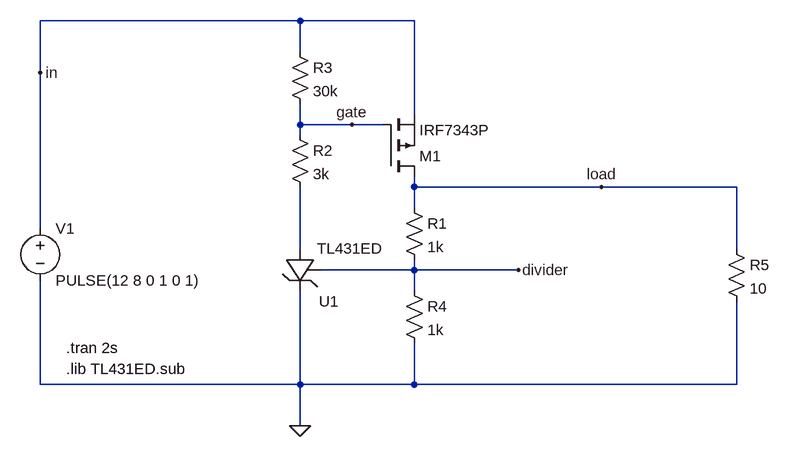
[diagram p0: schematic low_voltage_cut_off.asc]
low_voltage_cut_off.asc, the LTspice schematic file:
Version 4
SHEET 1 880 680
WIRE 112 -192 -288 -192
WIRE 288 -192 112 -192
WIRE 112 -144 112 -192
WIRE -288 -112 -288 -192
WIRE 288 -48 288 -192
WIRE 112 -32 112 -64
WIRE 192 -32 112 -32
WIRE 240 -32 192 -32
WIRE 112 -16 112 -32
WIRE 288 64 288 48
WIRE 576 64 288 64
WIRE 784 64 576 64
WIRE 288 96 288 64
WIRE -288 128 -288 -112
WIRE 112 160 112 64
WIRE 784 160 784 64
WIRE 288 192 288 176
WIRE 288 192 144 192
WIRE 448 192 288 192
WIRE 288 224 288 192
WIRE -288 368 -288 208
WIRE 112 368 112 224
WIRE 112 368 -288 368
WIRE 288 368 288 304
WIRE 288 368 112 368
WIRE 784 368 784 240
WIRE 784 368 288 368
WIRE 112 432 112 368
FLAG 112 432 0
FLAG 576 64 load
FLAG 448 192 divider
FLAG 192 -32 gate
FLAG -288 -112 in
SYMBOL voltage -288 112 R0
WINDOW 123 0 0 Left 0
WINDOW 39 0 0 Left 0
SYMATTR InstName V1
SYMATTR Value PULSE(12 8 0 1 0 1)
SYMBOL res 272 80 R0
SYMATTR InstName R1
SYMATTR Value 1k
SYMBOL res 96 -32 R0
SYMATTR InstName R2
SYMATTR Value 3k
SYMBOL res 96 -160 R0
SYMATTR InstName R3
SYMATTR Value 30k
SYMBOL pmos 240 48 M180
SYMATTR InstName M1
SYMATTR Value IRF7343P
SYMBOL res 272 208 R0
SYMATTR InstName R4
SYMATTR Value 1k
SYMBOL res 768 144 R0
SYMATTR InstName R5
SYMATTR Value 10
SYMBOL TL431 112 192 M180
SYMATTR InstName U1
TEXT -248 312 Left 2 !.tran 2s
TEXT -248 344 Left 2 !.lib TL431ED.sub

The netlist it stands for:
* low_voltage_cut_off.asc
V1 in 0 PULSE(12 8 0 1 0 1)
R1 load divider 1k
R2 gate N001 3k
R3 in gate 30k
M1 load gate in in IRF7343P
R4 divider 0 1k
R5 load 0 10
XU1 0 N001 divider TL431ED  ; pins CATHODE ANODE REF
.model NMOS NMOS
.model PMOS PMOS
.lib standard.mos
.tran 2s
.lib TL431ED.sub
.backanno
.end